# Altium schematic sheet RS485.SchDoc: RS485 Module
size 420 x 297 mm; SheetNumber: 6
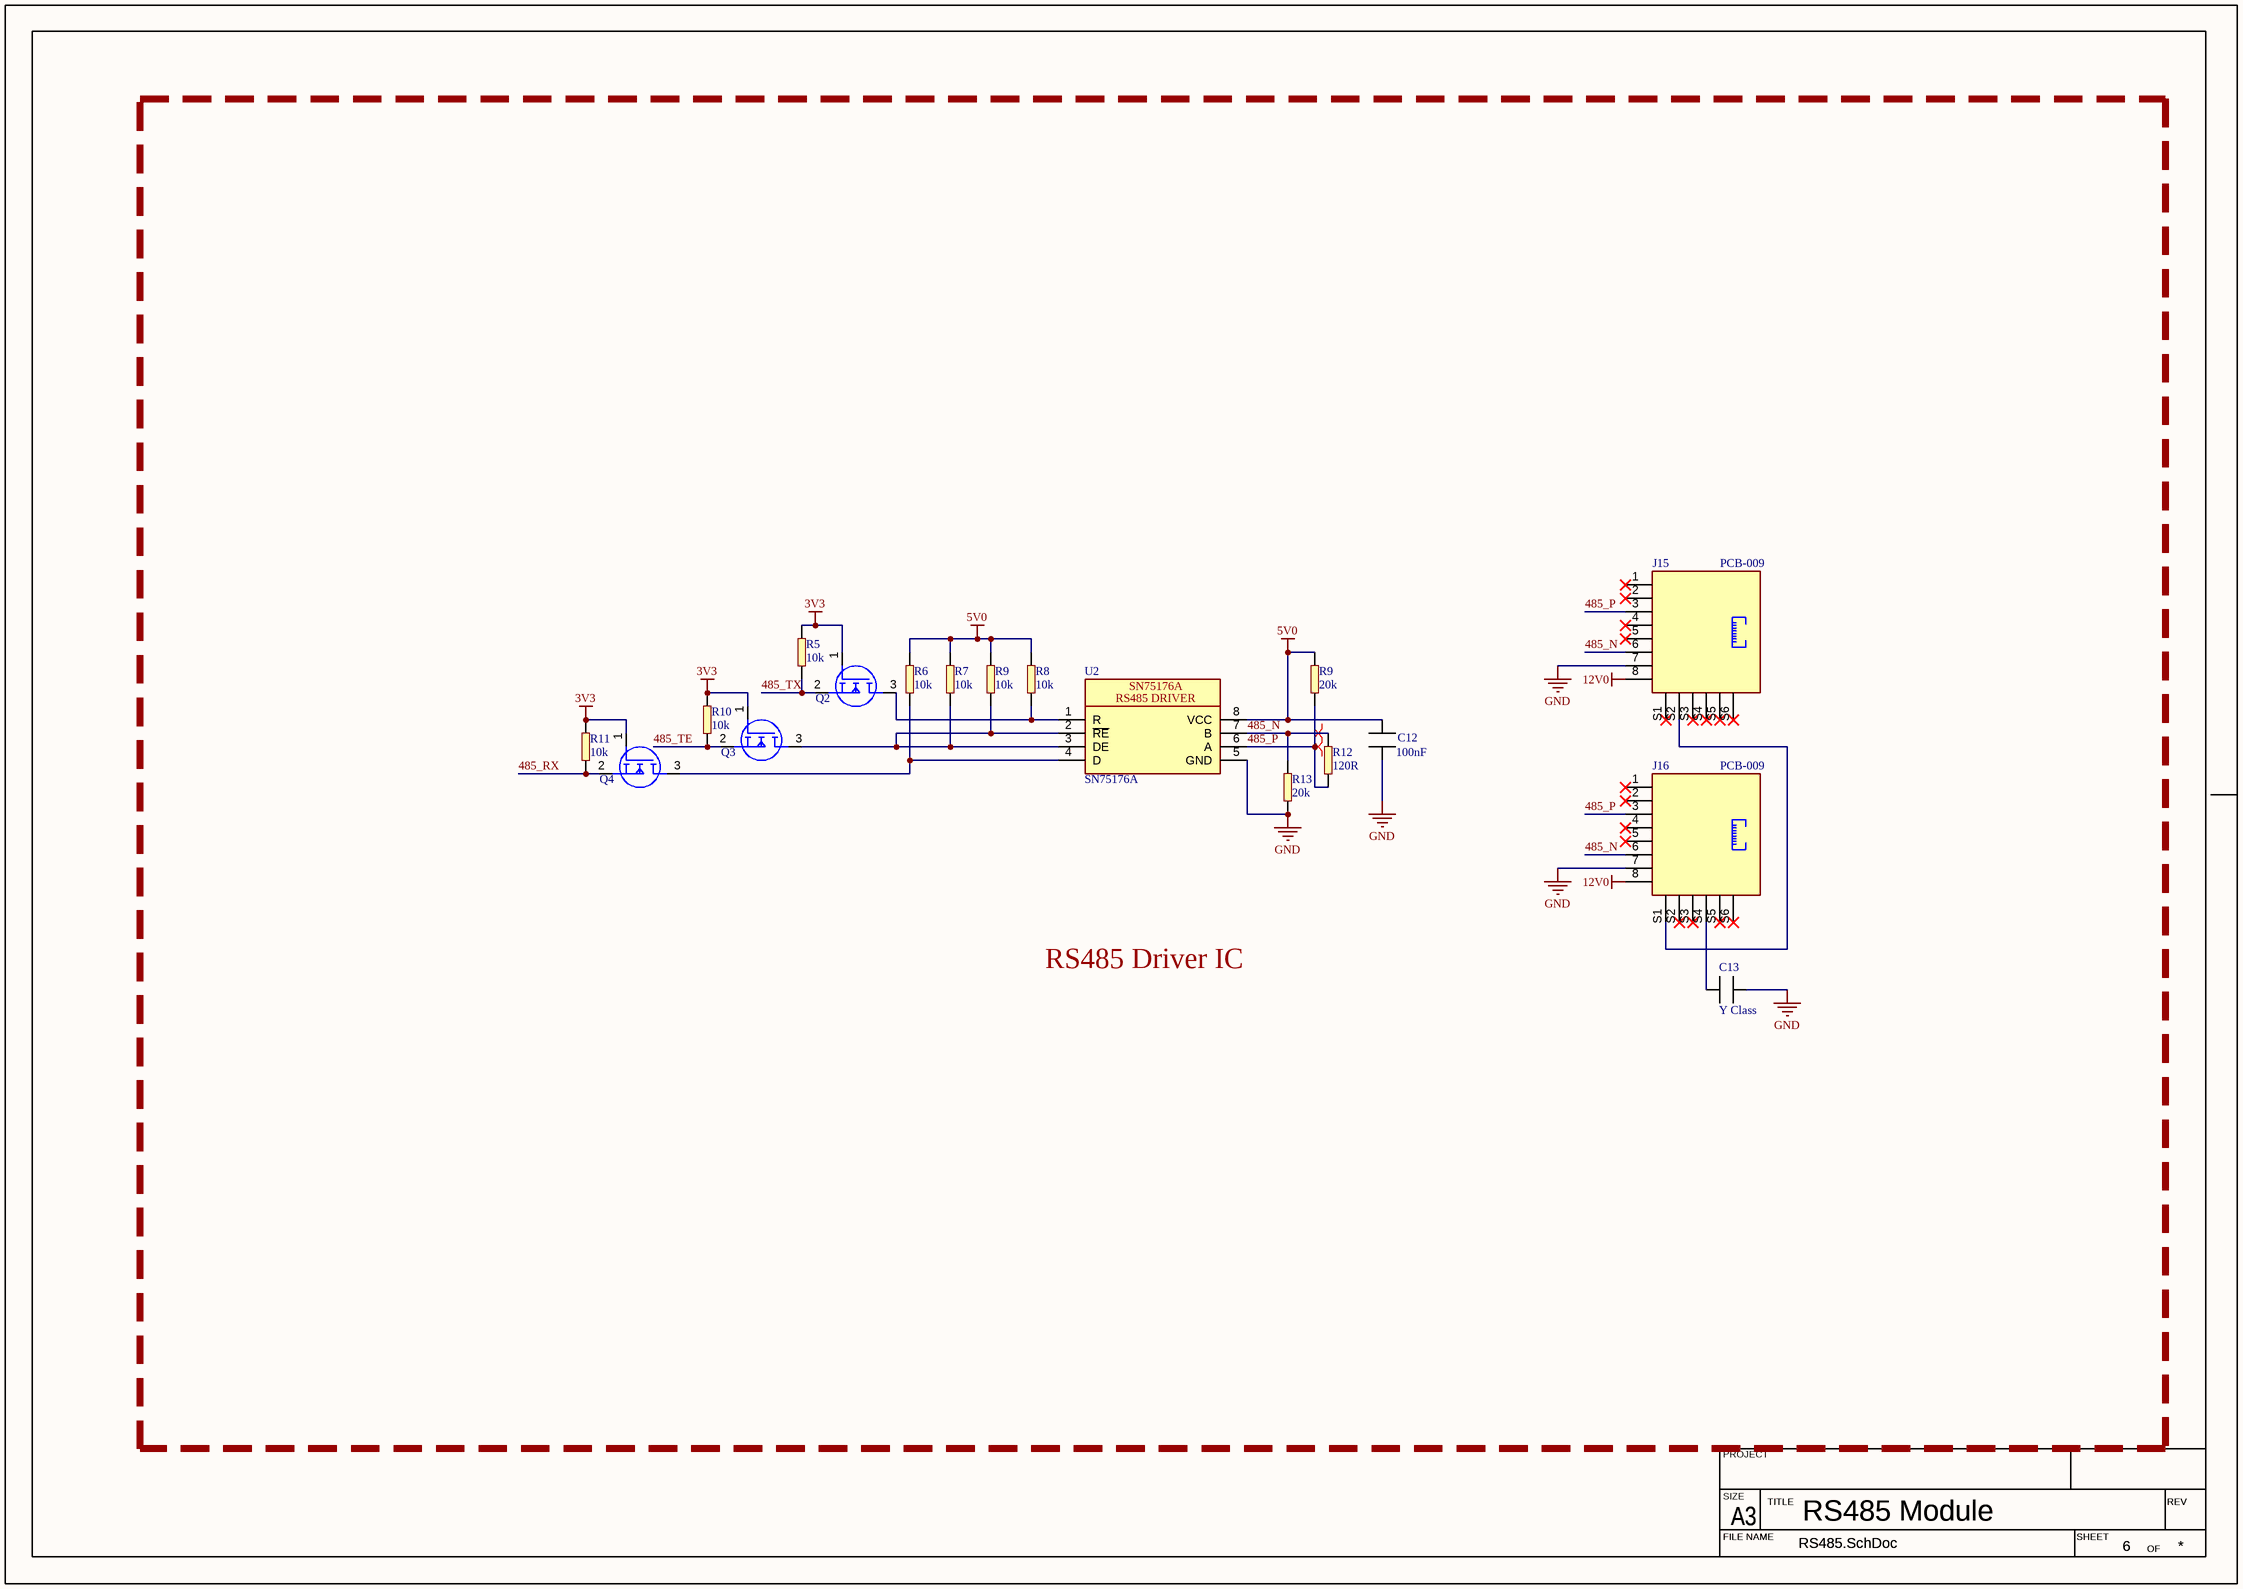
[diagram p0: RS485.SchDoc]

## Parts
(Parts that share a designator on the sheet are numbered #1, #2 ... from top to bottom, then left to right.)
C12  value 100nF  [CAPC2012X13L]  (hidden comment: MLCC_0805)
C13  value Y Class  [VY1222M43Y5UC63V0]  (hidden comment: VY1)
J15  value PCB-009  [PCB-009]  (hidden comment: ERP_148-3)
J16  value PCB-009  [PCB-009]  (hidden comment: ERP_148-3)
Q2  BSS138L  [BSS138L]  (value not drawn)
Q3  BSS138L  [BSS138L]  (value not drawn)
Q4  BSS138L  [BSS138L]  (value not drawn)
R5  value 10k  [RES_0603]  (hidden comment: ERP_101-1)
R6  value 10k  [RES_0603]  (hidden comment: ERP_101-1)
R7  value 10k  [RES_0603]  (hidden comment: ERP_101-1)
R8  value 10k  [RES_0603]  (hidden comment: ERP_101-1)
R9#1  value 10k  [RES_0603]  (hidden comment: ERP_101-1)  (graphical)
R9#2  value 20k  [RES_0603]  (hidden comment: ERP_101-1)
R10  value 10k  [RES_0603]  (hidden comment: ERP_101-1)
R11  value 10k  [RES_0603]  (hidden comment: ERP_101-1)
R12  value 120R  [RES_0603]  (hidden comment: ERP_101-1)
R13  value 20k  [RES_0603]  (hidden comment: ERP_101-1)
U2  SN75176A  [SN75176A]

## Blocks framed on the sheet
RS485 Driver IC: C12 C13 J15 J16 Q2-Q4 R5-R8 R9#1 R9#2 R10-R13 U2

## Nets
3V3: Q2.1(G) Q3.1(G) Q4.1(G) R5.1 R10.1 R11.1
5V0: C12.1 R6.1 R7.1 R8.1 R9#1.1 R9#2.1 U2.8(VCC)
12V0: J15.8 J16.8
GND: C12.2 C13.2 J15.7 J16.7 R13.2 U2.5(GND)
485_N: J15.6 J16.6 R12.1 R13.1 U2.7(B)
485_P: J15.3 J16.3 R9#2.2 R12.2 U2.6(A)
485_RX: Q4.2(S) R11.2
485_TE: Q3.2(S) R10.2
485_TX: Q2.2(S) R5.2
NetC13_1: C13.1 J16.S4
NetJ15_S2: J15.S2 J16.S1
NetQ2_3: Q2.3(D) R8.2 U2.1(R)
NetQ3_3: Q3.3(D) R7.2 R9#1.2 U2.2(~{RE}) U2.3(DE)
NetQ4_3: Q4.3(D) R6.2 U2.4(D)

Not connected (* = marked no-connect by the designer): J15 1* 2* 4* 5* S1* S3* S4* S5* S6*; J16 1* 2* 4* 5* S2* S3* S5* S6*

## Layout directives
differential pair; differential pair class 485_120R; rule Differential Pairs Routing [Pref Gap = 0.254mm    Min Gap  = 0.254mm    Max Gap  = 0.254mmPref Width = 0.42mm    Min Width  = 0.42mm    Max Width  = 0.42mm]: 485_N
differential pair; rule Differential Pairs Routing [Pref Gap = 0.254mm    Min Gap  = 0.254mm    Max Gap  = 0.254mmPref Width = 0.42mm    Min Width  = 0.42mm    Max Width  = 0.42mm]; differential pair class 485_120R: 485_P

## Notes on the sheet
- PROJECT
- SIZE
- FILE NAME
- A3
- TITLE
- SHEET
- OF
- REV
- (in symbol SN75176A) RS485 DRIVER

## Library data of the parts
C12 = MLCC_0805: Chip Capacitor, 2-Leads, Body 2.00x1.25mm, IPC High Density; Package: 0805; Manufacturer 1: *; Manufacturer Part Number 1: *
C13 = VY1: Ceramic Capacitor Y5U (E) Radial, Disc; Manufacturer 1: *; Manufacturer Part Number 1: *
J15 J16 = RJ45_Top_Entry: PCB-009 Robu; Manufacturer Part Number 1: *; Manufacturer 1: *; Supplier Part Number 1: *; Supplier 1: *; ERP: *; Package: 8P8C
Q2-Q4 = BSS138L: NMOS; Manufacturer Part Number 1: BSS138LT1G; Manufacturer 1: ON; Value: *; ERP: *; Supplier Part Number 1: *; Supplier 1: *; Package: SOT23-3
R5-R8 R9#1 R10 R11 = RES_0603: Package: 0603; Manufacturer 1: *; Manufacturer Part Number 1: *
R9#2 R12 R13 = RES_0603: Manufacturer Part Number 1: 560112116003; Package: 0603; Manufacturer 1: *
U2 = SN75176A: RS485/422 Driver IC; Manufacturer 1: Sunrom; Manufacturer Part Number 1: 3875; Value: SN75176A